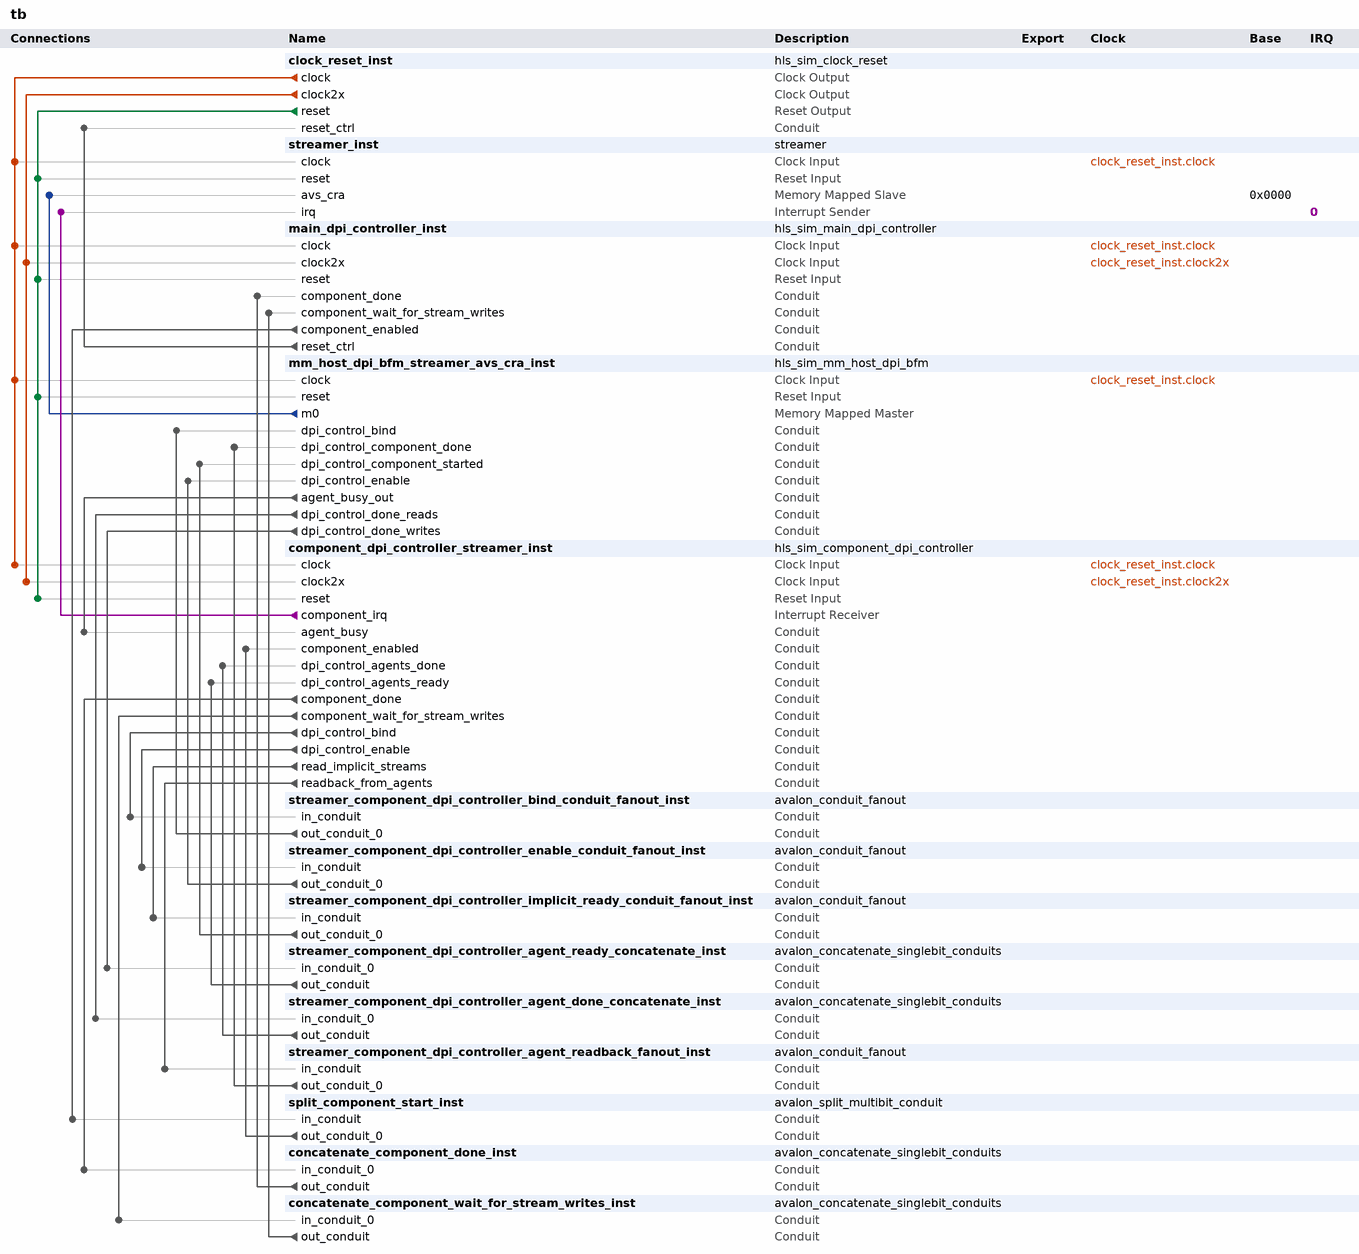
[diagram p0: system contents]
# Platform Designer (Qsys) system tb, Cyclone V 5CGXFC3B6F23C6
# Parameters at their usual value, and those the tool derives, are not listed.
package require qsys
create_system tb
set_project_property DEVICE_FAMILY {Cyclone V}
set_project_property DEVICE 5CGXFC3B6F23C6

add_instance clock_reset_inst hls_sim_clock_reset 1.0
set_instance_parameter_value clock_reset_inst RESET_CYCLE_HOLD 4

add_instance streamer_inst streamer 1.0

add_instance main_dpi_controller_inst hls_sim_main_dpi_controller 1.0
set_instance_parameter_value main_dpi_controller_inst COMPONENT_NAMES_STR streamer
set_instance_parameter_value main_dpi_controller_inst NUM_COMPONENTS 1

add_instance mm_host_dpi_bfm_streamer_avs_cra_inst hls_sim_mm_host_dpi_bfm 1.0
set_instance_parameter_value mm_host_dpi_bfm_streamer_avs_cra_inst ADDRESS_UNITS SYMBOLS
set_instance_parameter_value mm_host_dpi_bfm_streamer_avs_cra_inst AV_ADDRESS_W 7
set_instance_parameter_value mm_host_dpi_bfm_streamer_avs_cra_inst AV_BURSTCOUNT_W 1
set_instance_parameter_value mm_host_dpi_bfm_streamer_avs_cra_inst AV_BURST_BNDR_ONLY 1
set_instance_parameter_value mm_host_dpi_bfm_streamer_avs_cra_inst AV_BURST_LINEWRAP 1
set_instance_parameter_value mm_host_dpi_bfm_streamer_avs_cra_inst AV_FIX_READ_LATENCY 1
set_instance_parameter_value mm_host_dpi_bfm_streamer_avs_cra_inst AV_NUMSYMBOLS 8
set_instance_parameter_value mm_host_dpi_bfm_streamer_avs_cra_inst AV_READ_WAIT_TIME 0
set_instance_parameter_value mm_host_dpi_bfm_streamer_avs_cra_inst AV_REGISTERINCOMINGSIGNALS 0
set_instance_parameter_value mm_host_dpi_bfm_streamer_avs_cra_inst AV_SYMBOL_W 8
set_instance_parameter_value mm_host_dpi_bfm_streamer_avs_cra_inst AV_WRITE_WAIT_TIME 0
set_instance_parameter_value mm_host_dpi_bfm_streamer_avs_cra_inst COMPONENT_AGENT_READ_INTERFACE_NAME {$return}
set_instance_parameter_value mm_host_dpi_bfm_streamer_avs_cra_inst COMPONENT_AGENT_WRITE_INTERFACE_NAME __ihc_hls_avs_write_stream__
set_instance_parameter_value mm_host_dpi_bfm_streamer_avs_cra_inst COMPONENT_CRA_AGENT 1
set_instance_parameter_value mm_host_dpi_bfm_streamer_avs_cra_inst COMPONENT_HAS_AGENT_RETURN 1
set_instance_parameter_value mm_host_dpi_bfm_streamer_avs_cra_inst COMPONENT_NAME streamer
set_instance_parameter_value mm_host_dpi_bfm_streamer_avs_cra_inst NUM_AGENT_MEMORIES 0
set_instance_parameter_value mm_host_dpi_bfm_streamer_avs_cra_inst REGISTER_WAITREQUEST 0
set_instance_parameter_value mm_host_dpi_bfm_streamer_avs_cra_inst USE_ADDRESS 1
set_instance_parameter_value mm_host_dpi_bfm_streamer_avs_cra_inst USE_BEGIN_BURST_TRANSFER 0
set_instance_parameter_value mm_host_dpi_bfm_streamer_avs_cra_inst USE_BEGIN_TRANSFER 0
set_instance_parameter_value mm_host_dpi_bfm_streamer_avs_cra_inst USE_BURSTCOUNT 0
set_instance_parameter_value mm_host_dpi_bfm_streamer_avs_cra_inst USE_BYTE_ENABLE 1
set_instance_parameter_value mm_host_dpi_bfm_streamer_avs_cra_inst USE_READ 1
set_instance_parameter_value mm_host_dpi_bfm_streamer_avs_cra_inst USE_READ_DATA 1
set_instance_parameter_value mm_host_dpi_bfm_streamer_avs_cra_inst USE_READ_DATA_VALID 1
set_instance_parameter_value mm_host_dpi_bfm_streamer_avs_cra_inst USE_WAIT_REQUEST 1
set_instance_parameter_value mm_host_dpi_bfm_streamer_avs_cra_inst USE_WRITE 1
set_instance_parameter_value mm_host_dpi_bfm_streamer_avs_cra_inst USE_WRITE_DATA 1

add_instance component_dpi_controller_streamer_inst hls_sim_component_dpi_controller 1.0
set_instance_parameter_value component_dpi_controller_streamer_inst COMPONENT_HAS_AGENT_RETURN 1
set_instance_parameter_value component_dpi_controller_streamer_inst COMPONENT_MANGLED_NAME "\\3fstreamer@@YA\\3fAUTuple@@U1@@Z"
set_instance_parameter_value component_dpi_controller_streamer_inst COMPONENT_NAME streamer
set_instance_parameter_value component_dpi_controller_streamer_inst COMPONENT_NUM_AGENTS 1
set_instance_parameter_value component_dpi_controller_streamer_inst COMPONENT_NUM_OUTPUT_STREAMS 0
set_instance_parameter_value component_dpi_controller_streamer_inst RETURN_DATAWIDTH 64

add_instance streamer_component_dpi_controller_bind_conduit_fanout_inst avalon_conduit_fanout 1.0
set_instance_parameter_value streamer_component_dpi_controller_bind_conduit_fanout_inst numFanOut 1

add_instance streamer_component_dpi_controller_enable_conduit_fanout_inst avalon_conduit_fanout 1.0
set_instance_parameter_value streamer_component_dpi_controller_enable_conduit_fanout_inst numFanOut 1

add_instance streamer_component_dpi_controller_implicit_ready_conduit_fanout_inst avalon_conduit_fanout 1.0
set_instance_parameter_value streamer_component_dpi_controller_implicit_ready_conduit_fanout_inst numFanOut 1

add_instance streamer_component_dpi_controller_agent_ready_concatenate_inst avalon_concatenate_singlebit_conduits 1.0
set_instance_parameter_value streamer_component_dpi_controller_agent_ready_concatenate_inst multibit_width 1

add_instance streamer_component_dpi_controller_agent_done_concatenate_inst avalon_concatenate_singlebit_conduits 1.0
set_instance_parameter_value streamer_component_dpi_controller_agent_done_concatenate_inst multibit_width 1

add_instance streamer_component_dpi_controller_agent_readback_fanout_inst avalon_conduit_fanout 1.0
set_instance_parameter_value streamer_component_dpi_controller_agent_readback_fanout_inst numFanOut 1

add_instance split_component_start_inst avalon_split_multibit_conduit 1.0
set_instance_parameter_value split_component_start_inst multibit_width 1

add_instance concatenate_component_done_inst avalon_concatenate_singlebit_conduits 1.0
set_instance_parameter_value concatenate_component_done_inst multibit_width 1

add_instance concatenate_component_wait_for_stream_writes_inst avalon_concatenate_singlebit_conduits 1.0
set_instance_parameter_value concatenate_component_wait_for_stream_writes_inst multibit_width 1

# connections
add_connection clock_reset_inst.clock component_dpi_controller_streamer_inst.clock clock
add_connection clock_reset_inst.clock main_dpi_controller_inst.clock clock
add_connection clock_reset_inst.clock mm_host_dpi_bfm_streamer_avs_cra_inst.clock clock
add_connection clock_reset_inst.clock streamer_inst.clock clock
add_connection clock_reset_inst.clock2x component_dpi_controller_streamer_inst.clock2x clock
add_connection clock_reset_inst.clock2x main_dpi_controller_inst.clock2x clock
add_connection clock_reset_inst.reset component_dpi_controller_streamer_inst.reset reset
add_connection clock_reset_inst.reset main_dpi_controller_inst.reset reset
add_connection clock_reset_inst.reset mm_host_dpi_bfm_streamer_avs_cra_inst.reset reset
add_connection clock_reset_inst.reset streamer_inst.reset reset
add_connection mm_host_dpi_bfm_streamer_avs_cra_inst.m0 streamer_inst.avs_cra avalon
set_connection_parameter_value mm_host_dpi_bfm_streamer_avs_cra_inst.m0/streamer_inst.avs_cra baseAddress 0x0000
add_connection component_dpi_controller_streamer_inst.component_done concatenate_component_done_inst.in_conduit_0 conduit
add_connection component_dpi_controller_streamer_inst.component_wait_for_stream_writes concatenate_component_wait_for_stream_writes_inst.in_conduit_0 conduit
add_connection component_dpi_controller_streamer_inst.dpi_control_bind streamer_component_dpi_controller_bind_conduit_fanout_inst.in_conduit conduit
add_connection component_dpi_controller_streamer_inst.dpi_control_enable streamer_component_dpi_controller_enable_conduit_fanout_inst.in_conduit conduit
add_connection component_dpi_controller_streamer_inst.read_implicit_streams streamer_component_dpi_controller_implicit_ready_conduit_fanout_inst.in_conduit conduit
add_connection component_dpi_controller_streamer_inst.readback_from_agents streamer_component_dpi_controller_agent_readback_fanout_inst.in_conduit conduit
add_connection concatenate_component_done_inst.out_conduit main_dpi_controller_inst.component_done conduit
add_connection concatenate_component_wait_for_stream_writes_inst.out_conduit main_dpi_controller_inst.component_wait_for_stream_writes conduit
add_connection main_dpi_controller_inst.component_enabled split_component_start_inst.in_conduit conduit
add_connection main_dpi_controller_inst.reset_ctrl clock_reset_inst.reset_ctrl conduit
add_connection mm_host_dpi_bfm_streamer_avs_cra_inst.agent_busy_out component_dpi_controller_streamer_inst.agent_busy conduit
add_connection mm_host_dpi_bfm_streamer_avs_cra_inst.dpi_control_done_reads streamer_component_dpi_controller_agent_done_concatenate_inst.in_conduit_0 conduit
add_connection mm_host_dpi_bfm_streamer_avs_cra_inst.dpi_control_done_writes streamer_component_dpi_controller_agent_ready_concatenate_inst.in_conduit_0 conduit
add_connection split_component_start_inst.out_conduit_0 component_dpi_controller_streamer_inst.component_enabled conduit
add_connection streamer_component_dpi_controller_agent_done_concatenate_inst.out_conduit component_dpi_controller_streamer_inst.dpi_control_agents_done conduit
add_connection streamer_component_dpi_controller_agent_readback_fanout_inst.out_conduit_0 mm_host_dpi_bfm_streamer_avs_cra_inst.dpi_control_component_done conduit
add_connection streamer_component_dpi_controller_agent_ready_concatenate_inst.out_conduit component_dpi_controller_streamer_inst.dpi_control_agents_ready conduit
add_connection streamer_component_dpi_controller_bind_conduit_fanout_inst.out_conduit_0 mm_host_dpi_bfm_streamer_avs_cra_inst.dpi_control_bind conduit
add_connection streamer_component_dpi_controller_enable_conduit_fanout_inst.out_conduit_0 mm_host_dpi_bfm_streamer_avs_cra_inst.dpi_control_enable conduit
add_connection streamer_component_dpi_controller_implicit_ready_conduit_fanout_inst.out_conduit_0 mm_host_dpi_bfm_streamer_avs_cra_inst.dpi_control_component_started conduit
add_connection component_dpi_controller_streamer_inst.component_irq streamer_inst.irq interrupt
set_connection_parameter_value component_dpi_controller_streamer_inst.component_irq/streamer_inst.irq irqNumber 0

set_interconnect_requirement {$system} qsys_mm.clockCrossingAdapter HANDSHAKE
set_interconnect_requirement {$system} qsys_mm.enableEccProtection FALSE
set_interconnect_requirement {$system} qsys_mm.insertDefaultSlave FALSE
set_interconnect_requirement {$system} qsys_mm.maxAdditionalLatency 1

save_system tb.qsys
